# EAGLE design USB90uC-20110518 (EAGLE 5.11)
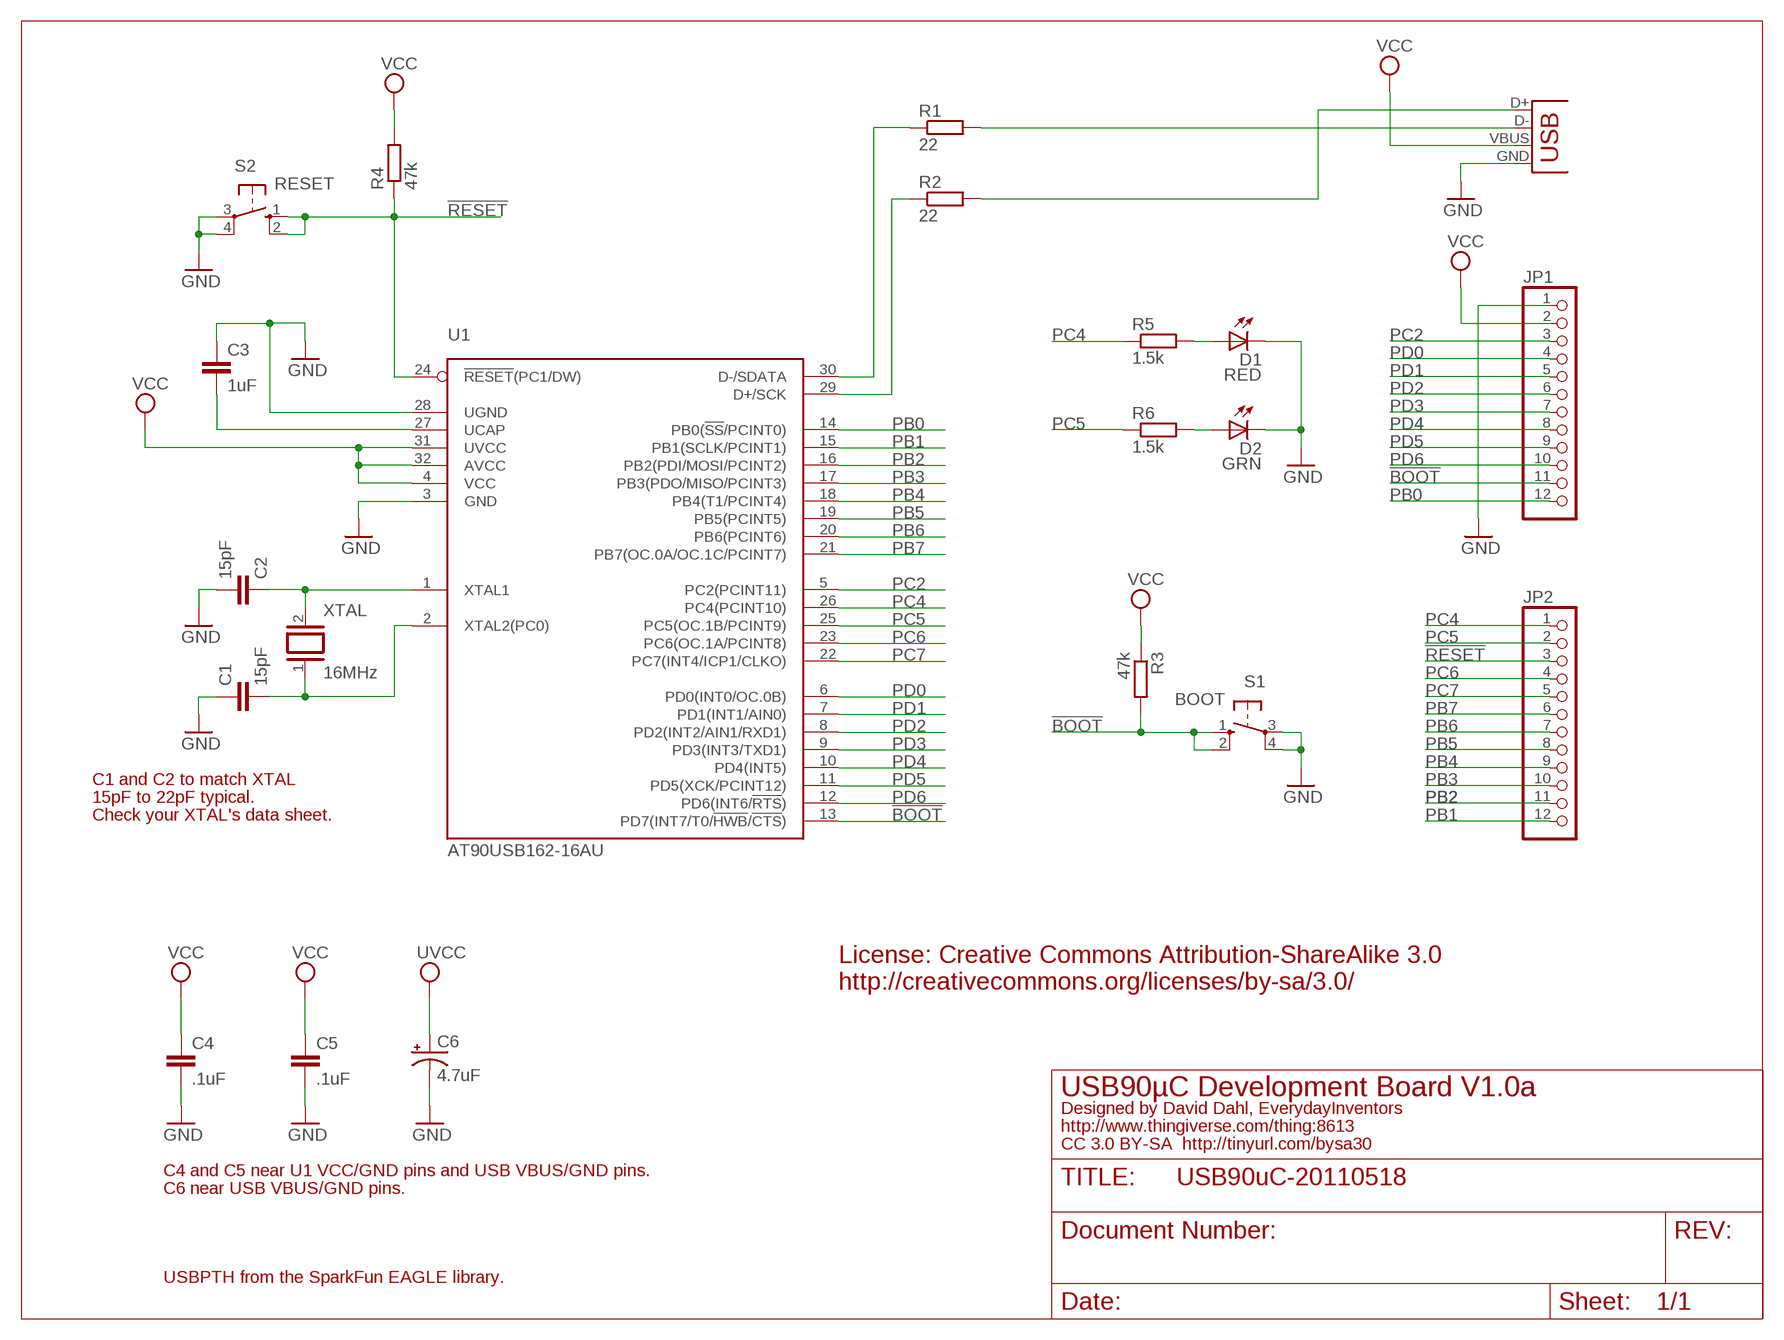
[diagram p0: schematic, sheet 1]

## Parts
C1  15pF  C-EU025-024X044  [C025-024X044]
C2  15pF  C-EU025-024X044  [C025-024X044]
C3  1uF  C-EU050-025X075  [C050-025X075]
C4  .1uF  C-EU050-025X075  [C050-025X075]
C5  .1uF  C-EU050-025X075  [C050-025X075]
C6  4.7uF  CPOL-USE5-4  [E5-4]
D1  RED  LED3MM  [LED3MM]
D2  GRN  LED3MM  [LED3MM]
JP1  PINHD-1X12_2.54-S  [1X12-S]
JP2  PINHD-1X12_2.54-S  [1X12-S]
R1  22  R-EU_0207/10  [0207/10]
R2  22  R-EU_0207/10  [0207/10]
R3  47k  R-EU_0207/10  [0207/10]
R4  47k  R-EU_0207/10  [0207/10]
R5  1.5k  R-EU_0207/10  [0207/10]
R6  1.5k  R-EU_0207/10  [0207/10]
S1  BOOT  10-XX  [B3F-10XX]
S2  RESET  10-XX  [B3F-10XX]
U1  AT90USB162-16AU  [VQFP32]
USB1  USBPTH  [USB-B-PTH]
XTAL  16MHz  XTAL/S  [QS]

## Nets
!BOOT: JP1.11 R3.2 S1.1(S) S1.2(S1) U1.13(PD7(INT7/T0/!HWB!/!CTS!))
!RESET: JP2.3 R4.1 S2.1(S) S2.2(S1) U1.24(!RESET!(PC1/DW))
GND: C1.1 C2.2 C3.1 C4.2 C5.2 C6.- D1.K(C) D2.K(C) JP1.1 S1.3(P) S1.4(P1) S2.3(P) S2.4(P1) U1.3(GND) U1.28(UGND) USB1.GND
N$1: C2.1 U1.1(XTAL1) XTAL.2
N$2: C1.2 U1.2(XTAL2(PC0)) XTAL.1
N$3: R1.2 USB1.D-
N$4: R1.1 U1.30(D-/SDATA)
N$5: R2.1 U1.29(D+/SCK)
N$6: R2.2 USB1.D+
N$10: C3.2 U1.27(UCAP)
N$12: D1.A R5.2
N$13: D2.A R6.2
PB0: JP1.12 U1.14(PB0(!SS!/PCINT0))
PB1: JP2.12 U1.15(PB1(SCLK/PCINT1))
PB2: JP2.11 U1.16(PB2(PDI/MOSI/PCINT2))
PB3: JP2.10 U1.17(PB3(PDO/MISO/PCINT3))
PB4: JP2.9 U1.18(PB4(T1/PCINT4))
PB5: JP2.8 U1.19(PB5(PCINT5))
PB6: JP2.7 U1.20(PB6(PCINT6))
PB7: JP2.6 U1.21(PB7(OC.0A/OC.1C/PCINT7))
PC2: JP1.3 U1.5(PC2(PCINT11))
PC4: JP2.1 R5.1 U1.26(PC4(PCINT10))
PC5: JP2.2 R6.1 U1.25(PC5(OC.1B/PCINT9))
PC6: JP2.4 U1.23(PC6(OC.1A/PCINT8))
PC7: JP2.5 U1.22(PC7(INT4/ICP1/CLKO))
PD0: JP1.4 U1.6(PD0(INT0/OC.0B))
PD1: JP1.5 U1.7(PD1(INT1/AIN0))
PD2: JP1.6 U1.8(PD2(INT2/AIN1/RXD1))
PD3: JP1.7 U1.9(PD3(INT3/TXD1))
PD4: JP1.8 U1.10(PD4(INT5))
PD5: JP1.9 U1.11(PD5(XCK/PCINT12))
PD6: JP1.10 U1.12(PD6(INT6/!RTS!))
VCC: C4.1 C5.1 C6.+ JP1.2 R3.1 R4.2 U1.4(VCC) U1.31(UVCC) U1.32(AVCC) USB1.VBUS ; supply symbol labelled UVCC

## Notes on the sheet
- C1 and C2 to match XTAL
- 15pF to 22pF typical.
- Check your XTAL's data sheet.
- License: Creative Commons Attribution-ShareAlike 3.0
- http://creativecommons.org/licenses/by-sa/3.0/
- USB90µC Development Board V1.0a
- Designed by David Dahl, EverydayInventors
- http://www.thingiverse.com/thing:8613
- CC 3.0 BY-SA  http://tinyurl.com/bysa30
- C4 and C5 near U1 VCC/GND pins and USB VBUS/GND pins.
- C6 near USB VBUS/GND pins.
- USBPTH from the SparkFun EAGLE library.

## Library data of the parts
C1-C5 = rcl:C-EU: CAPACITOR, European symbol
C6 = rcl:CPOL-US: POLARIZED CAPACITOR, American symbol
D1 D2 = led:LED: LED OSRAM: - CHIPLED LG R971, LG N971, LY N971, LG Q971, LY Q971, LO R971, LY R971 LH N974, LH R974 LS Q976, LO Q976, LY Q976 LO Q996 - Hyper CHIPLED LW Q18S LB Q993, LB Q99A, LB R99A - SideLED LS A670, LO A670, LY A670, LG A670, LP A670 LB A673, LV A673, LT A673, LW A673 LH A674 LY A675 LS A676, LA A676, LO A676, LY A676, LW A676 LS A679, LY A679, LG A679 - Hyper Micro SIDELED® LS Y876, LA Y876, LO Y876, LY Y876 LT Y87S - SmartLED LW L88C, LW L88S LB L89C, LB L89S, LG L890 LS L89K, LO L89K, LY L89K LS L896, LA L896, LO L896, LY L896 - TOPLED LS T670, LO T670, LY T670, LG T670, LP T670 LSG T670, LSP T670, LSY T670, LOP T670, LYG T670 LG T671, LOG T671, LSG T671 LB T673, LV T673, LT T673, LW T673 LH T674 LS T676, LA T676, LO T676, LY T676, LB T676, LH T676, LSB T676, LW T676 LB T67C, LV T67C, LT T67C, LS T67K, LO T67K, LY T67K, LW E67C LS E67B, LA E67B, LO E67B, LY E67B, LB E67C, LV E67C, LT E67C LW T67C LS T679, LY T679, LG T679 LS T770, LO T770, LY T770, LG T770, LP T770 LB T773, LV T773, LT T773, LW T773 LH T774 LS E675, LA E675, LY E675, LS T675 LS T776, LA T776, LO T776, LY T776, LB T776 LHGB T686 LT T68C, LB T68C - Hyper Mini TOPLED® LB M676 - Mini TOPLED Santana® LG M470 LS M47K, LO M47K, LY M47K Source: http://www.osram.convergy.de LUXEON: - LUMILED® LXK2-PW12-R00, LXK2-PW12-S00, LXK2-PW14-U00, LXK2-PW14-V00 LXK2-PM12-R00, LXK2-PM12-S00, LXK2-PM14-U00 LXK2-PE12-Q00, LXK2-PE12-R00, LXK2-PE12-S00, LXK2-PE14-T00, LXK2-PE14-U00 LXK2-PB12-K00, LXK2-PB12-L00, LXK2-PB12-M00, LXK2-PB14-N00, LXK2-PB14-P00, LXK2-PB14-Q00 LXK2-PR12-L00, LXK2-PR12-M00, LXK2-PR14-Q00, LXK2-PR14-R00 LXK2-PD12-Q00, LXK2-PD12-R00, LXK2-PD12-S00 LXK2-PH12-R00, LXK2-PH12-S00 LXK2-PL12-P00, LXK2-PL12-Q00, LXK2-PL12-R00 Source: www.luxeon.com KINGBRIGHT: KA-3528ASYC Source: www.kingbright.com
JP1 JP2 = pinhead-2:PINHD-1X12: PIN HEADER
R1-R6 = rcl:R-EU_: RESISTOR, European symbol
S1 S2 = switch-omron:10-XX: OMRON SWITCH
U1 = at90usb:AT90USB162-16AU: 8-bit Microcontroller with 16K Bytes ISP Flash and USB Controller
USB1 = SparkFun:USB: USB Connectors USB-B-PTH is fully proven SKU : PRT-00139 USB-miniB is fully proven SKU : PRT-00587 USB-A-PCB is untested. USB-A-H is throughly reviewed, but untested. Spark Fun Electronics SKU : PRT-00437 USB-B-SMT is throughly reviewed, but untested. Needs silkscreen touching up. USB-A-S has not been used/tested USB-MB-H has not been used/tested
XTAL = special:XTAL/S: CRYSTAL

## Board
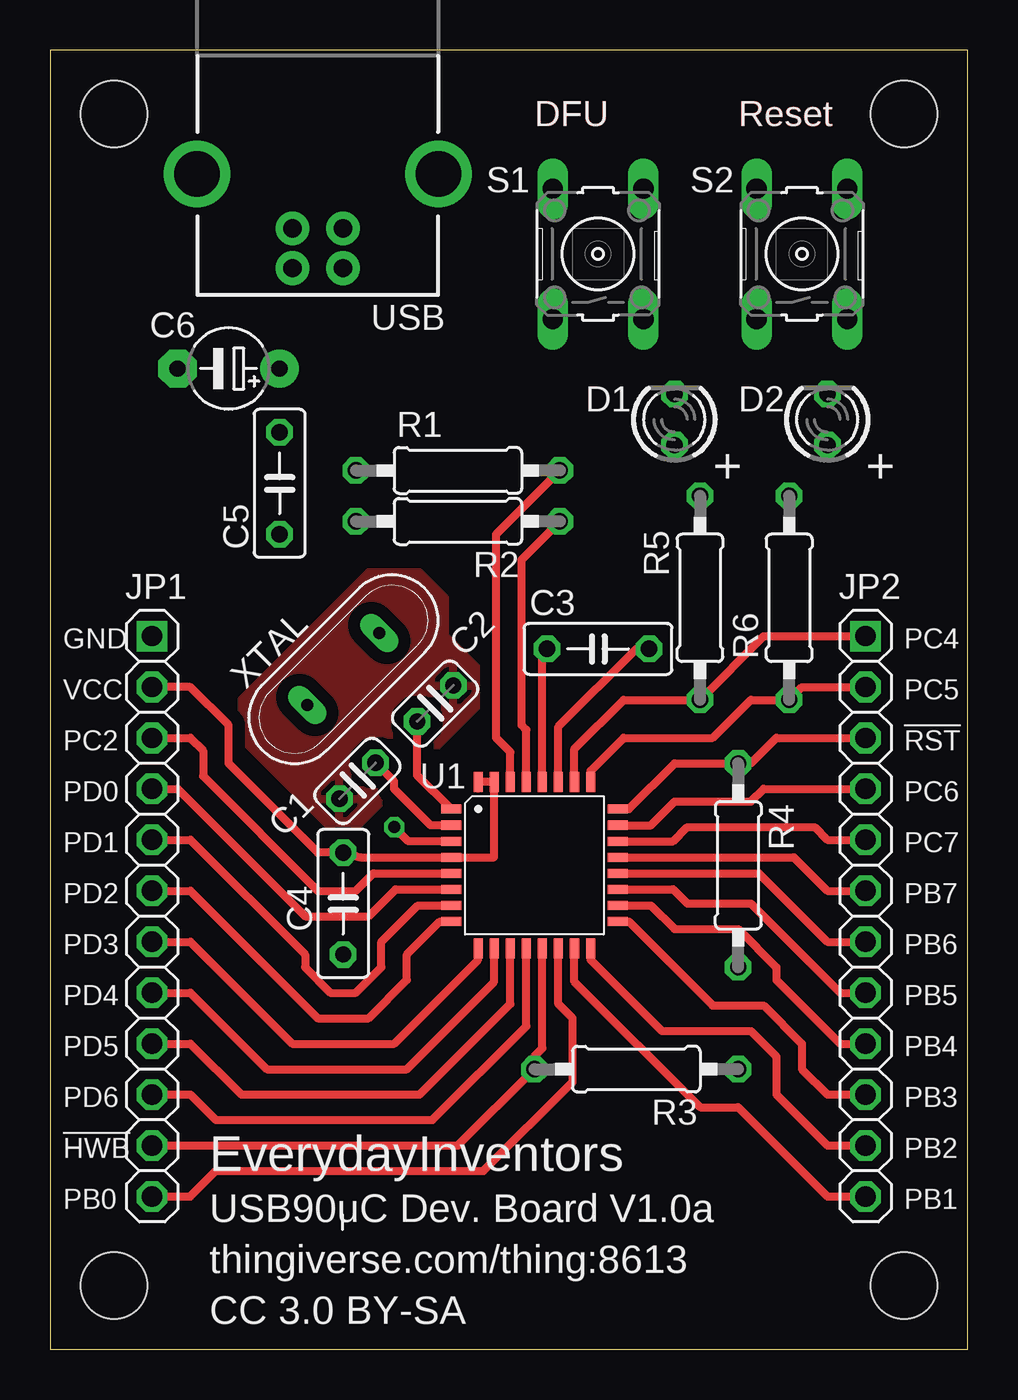
[diagram p1: board, top side]
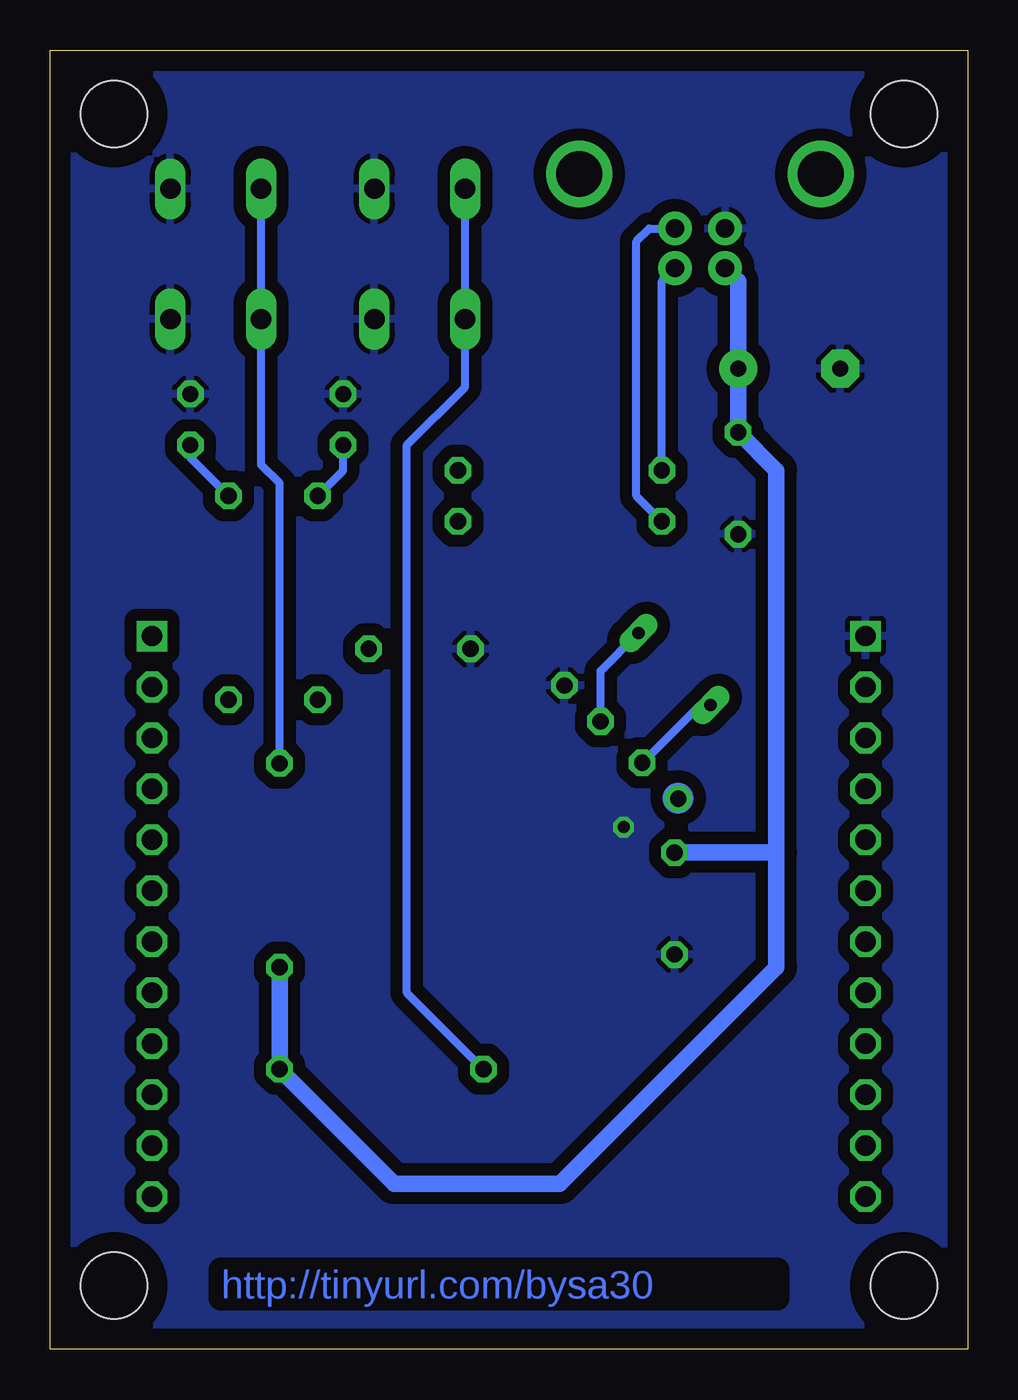
[diagram p2: board, bottom side, seen from below]

Size 45.72 x 64.77 mm. Coordinates in mm from the lower left corner, seen from the top.
Outline: 0,0 45.72,0 45.72,64.77 0,64.77 0,0
Copper layers (1*16): Top 0.035mm / dielectric 1.5mm / Bottom 0.035mm
Design rules "default *": minimum track width 10mil, minimum drill 18mil, track to track 8mil, track to pad 8mil, pad to pad 8mil, via to via 8mil, smd to smd 8mil, copper to edge 40mil, drill to drill 8mil, minimum pad ring 10mil, minimum via ring 8mil, stop-mask expansion 4mil, vias tented up to drill 24mil, thermal gap 10mil

### Footprints (pad centres in the part's own frame; a part is rotated, then mirrored left to right if it is on the bottom)
C025-024X044 = drill 0.813 octagon: 1 -1.27,0; 2 1.27,0
C050-025X075 = drill 0.813 octagon: 1 -2.54,0; 2 2.54,0
E5-4 = drill 0.813 pad 1.905 round: + -2.54,0 | drill 0.813 pad 1.905 octagon: - 2.54,0
LED3MM = drill 0.813 octagon: A -1.27,0; K 1.27,0
1X12-S = drill 1.016 square: 1 -13.97,0 | drill 1.016 octagon: 2 -11.43,0; 3 -8.89,0; 4 -6.35,0; 5 -3.81,0; 6 -1.27,0; 7 1.27,0; 8 3.81,0; 9 6.35,0; 10 8.89,0; 11 11.43,0; 12 13.97,0
0207/10 = drill 0.813 octagon: 1 -5.08,0; 2 5.08,0
B3F-10XX = drill 1.016 long: 1 -3.251,2.261; 2 3.251,2.261; 3 -3.251,-2.261; 4 3.251,-2.261
VQFP32 = smd 1 x 0.45: 1 -4.15,2.8; 2 -4.15,2; 3 -4.15,1.2; 4 -4.15,0.4; 5 -4.15,-0.4; 6 -4.15,-1.2; 7 -4.15,-2; 8 -4.15,-2.8; 17 4.15,-2.8; 18 4.15,-2; 19 4.15,-1.2; 20 4.15,-0.4; 21 4.15,0.4; 22 4.15,1.2; 23 4.15,2; 24 4.15,2.8 | smd 0.45 x 1: 9 -2.8,-4.15; 10 -2,-4.15; 11 -1.2,-4.15; 12 -0.4,-4.15; 13 0.4,-4.15; 14 1.2,-4.15; 15 2,-4.15; 16 2.8,-4.15; 25 2.8,4.15; 26 2,4.15; 27 1.2,4.15; 28 0.4,4.15; 29 -0.4,4.15; 30 -1.2,4.15; 31 -2,4.15; 32 -2.8,4.15
STAND-OFF = hole 3.302: 0,0
USB-B-PTH = drill 0.914 pad 1.676 round: D+ 0,1.25; D- 1.981,1.25; GND 0,-1.25; VBUS 1.981,-1.25 | drill 2.286 round: P$1 -2.718,-6.02; P$2 -2.718,6.02
QS = drill 0.61 long: 1 -2.54,0; 2 2.54,0

### Placement (x,y rotation side)
C1  15.32,28.34 45 top
C2  19.19,32.2 45 top
C3  27.3,34.92 0 top
C4  14.61,22.23 270 top
C5  11.43,43.18 270 top
C6  8.89,48.9 180 top
D1  31.11,46.35 90 top
D2  38.73,46.35 90 top
JP1  5.08,21.59 270 top
JP2  40.64,21.59 270 top
R1  20.32,43.81 180 top
R2  20.32,41.27 180 top
R3  29.21,13.97 180 top
R4  34.29,24.13 270 top
R5  32.38,37.47 90 top
R6  36.83,37.47 90 top
S1  27.3,54.61 90 top
S2  37.47,54.61 90 top
U1  24.13,24.13 0 top
U$1  [STAND-OFF]  3.17,61.59 0 top
U$2  [STAND-OFF]  42.55,61.59 0 top
U$3  [STAND-OFF]  42.55,3.17 0 top
U$4  [STAND-OFF]  3.17,3.17 0 top
USB1  13.34,55.88 270 top
XTAL  14.61,33.92 45 top

### Tracks (layer width: path | path; a pad name or v marks a point on that pad's centre or on a via)
!BOOT
  Top 0.406: JP1.11 20.32,10.16 R3.2 24.13,14.61 24.53,15.01 U1.13
  Bottom 0.406: R3.2 27.94,17.78 27.94,45.09 25.04,47.98 S1.1 S1.2
!RESET
  Top 0.406: U1.24 28.84,26.93 31.11,29.21 R4.1 34.92,29.21 36.2,30.48 JP2.3
  Bottom 0.406: R4.1 34.29,43.18 35.2,44.09 S2.1 S2.2
GND  (via drill 0.6)
  Top 0.406: U1.28 24.53,34.92 C3.1 | U1.3 17.85,25.33 v17.14,26.04
  pour Top (isolate 0.61): 18.41,38.73 15.88,38.73 9.53,32.38 9.53,30.48 14.61,25.4 22.23,33.02 19.68,35.56 19.68,37.47
  pour Bottom (isolate 0.61): 0.64,64.14 0.64,0.64 45.09,0.64 45.09,64.14
N$1
  Top 0.406: U1.1 18.29,28.62 C2.1
  Bottom 0.406: XTAL.2 18.29,33.82 C2.1
N$2
  Top 0.406: U1.2 18.95,26.13 17.14,27.94 17.14,28.31 C1.2
  Bottom 0.406: C1.2 13.34,32.12 XTAL.1
N$3
  Bottom 0.406: R1.2 15.24,53.24 USB1.D-
N$4
  Top 0.406: R1.1 22.23,40.64 22.23,30.48 22.93,29.77 U1.30
N$5
  Top 0.406: R2.1 23.5,39.37 23.5,31.11 23.73,30.88 U1.29
N$6
  Bottom 0.406: USB1.D+ 15.88,55.88 16.51,55.24 16.51,42.55 R2.2
N$10
  Top 0.406: U1.27 25.33,31.05 29.21,34.92 C3.2
N$12
  Bottom 0.406: R5.2 31.11,43.81 D1.A
N$13
  Bottom 0.406: R6.2 38.73,44.45 D2.A
PB0
  Top 0.406: U1.14 25.33,17.21 26.04,16.51 26.04,13.34 21.59,8.89 8.26,8.89 6.99,7.62 JP1.12
PB1
  Top 0.406: U1.15 26.13,18.32 32.38,12.06 34.29,12.06 38.73,7.62 JP2.12
PB2
  Top 0.406: U1.16 26.93,19.43 30.48,15.88 34.92,15.88 36.2,14.61 36.2,12.7 38.73,10.16 JP2.11
PB3
  Top 0.406: U1.17 28.84,21.33 33.02,17.14 35.56,17.14 37.47,15.24 37.47,13.97 38.73,12.7 JP2.10
PB4
  Top 0.406: U1.18 29.94,22.13 31.11,20.95 34.29,20.95 36.2,19.05 36.2,18.41 39.37,15.24 JP2.9
PB5
  Top 0.406: U1.19 31.05,22.93 31.75,22.23 34.92,22.23 39.37,17.78 JP2.8
PB6
  Top 0.406: U1.20 35.33,23.73 38.73,20.32 JP2.7
PB7
  Top 0.406: U1.21 37.06,24.53 38.73,22.86 JP2.6
PC2
  Top 0.406: JP1.3 6.99,30.48 7.62,29.84 7.62,28.57 13.34,22.86 15.24,22.86 16.11,23.73 U1.5
PC4
  Top 0.406: U1.26 26.13,29.94 28.57,32.38 R5.1 35.56,35.56 JP2.1
PC5
  Top 0.406: U1.25 26.93,28.84 28.57,30.48 33.02,30.48 34.92,32.38 R6.1 37.47,33.02 JP2.2
PC6
  Top 0.406: U1.23 29.94,26.13 31.11,27.3 34.92,27.3 35.56,27.94 JP2.4
PC7
  Top 0.406: U1.22 31.05,25.33 31.75,26.04 38.1,26.04 38.73,25.4 JP2.5
PD0
  Top 0.406: U1.6 17.21,22.93 15.88,21.59 12.7,21.59 6.35,27.94 JP1.4
PD1
  Top 0.406: U1.7 18.32,22.13 16.51,20.32 16.51,19.05 15.24,17.78 13.97,17.78 12.7,19.05 12.7,19.68 6.99,25.4 JP1.5
PD2
  Top 0.406: U1.8 19.43,21.33 17.78,19.68 17.78,18.41 15.88,16.51 13.34,16.51 6.99,22.86 JP1.6
PD3
  Top 0.406: U1.9 21.33,19.43 17.14,15.24 12.06,15.24 6.99,20.32 JP1.7
PD4
  Top 0.406: U1.10 22.13,18.32 17.78,13.97 10.79,13.97 6.99,17.78 JP1.8
PD5
  Top 0.406: U1.11 22.93,17.21 18.41,12.7 9.53,12.7 6.99,15.24 JP1.9
PD6
  Top 0.406: U1.12 23.73,16.11 19.05,11.43 8.26,11.43 6.99,12.7 JP1.10
VCC
  Top 0.406: 21.33,27.94 U1.32 U1.31 22.13,24.53 U1.4 15.47,24.53 15.2,24.61 | C4.1 15.2,24.61 | JP1.2 6.99,33.02 8.89,31.11 8.89,29.21 13.34,24.77 15.04,24.77 15.2,24.61
  Bottom 0.813: 9.53,24.77 9.53,19.05 20.32,8.26 28.57,8.26 R3.1 R4.2 | 9.53,24.77 9.53,43.81 C5.1 C6.+ 11.43,53.24 USB1.VBUS | 9.53,24.77 C4.1
(copper drawn outside any net)
  shapes: Bottom circle x1

### Text on the board
Top: DFU | Reset
Bottom: http://tinyurl.com/bysa30
tPlace: DFU | Reset | + | + | GND | PC4 | VCC | PC5 | PC2 | !RST | PD0 | PC6 | PD1 | PC7 | PD2 | PB7 | PD3 | PB6 | PD4 | PB5 | PD5 | PB4 | PD6 | PB3 | !HWB | PB2 | EverydayInventors | PB0 | PB1 | USB90uC Dev. Board V1.0a | thingiverse.com/thing:8613 | CC 3.0 BY-SA
tNames: USB